# EAGLE design prototype2 (EAGLE 9.3.0)
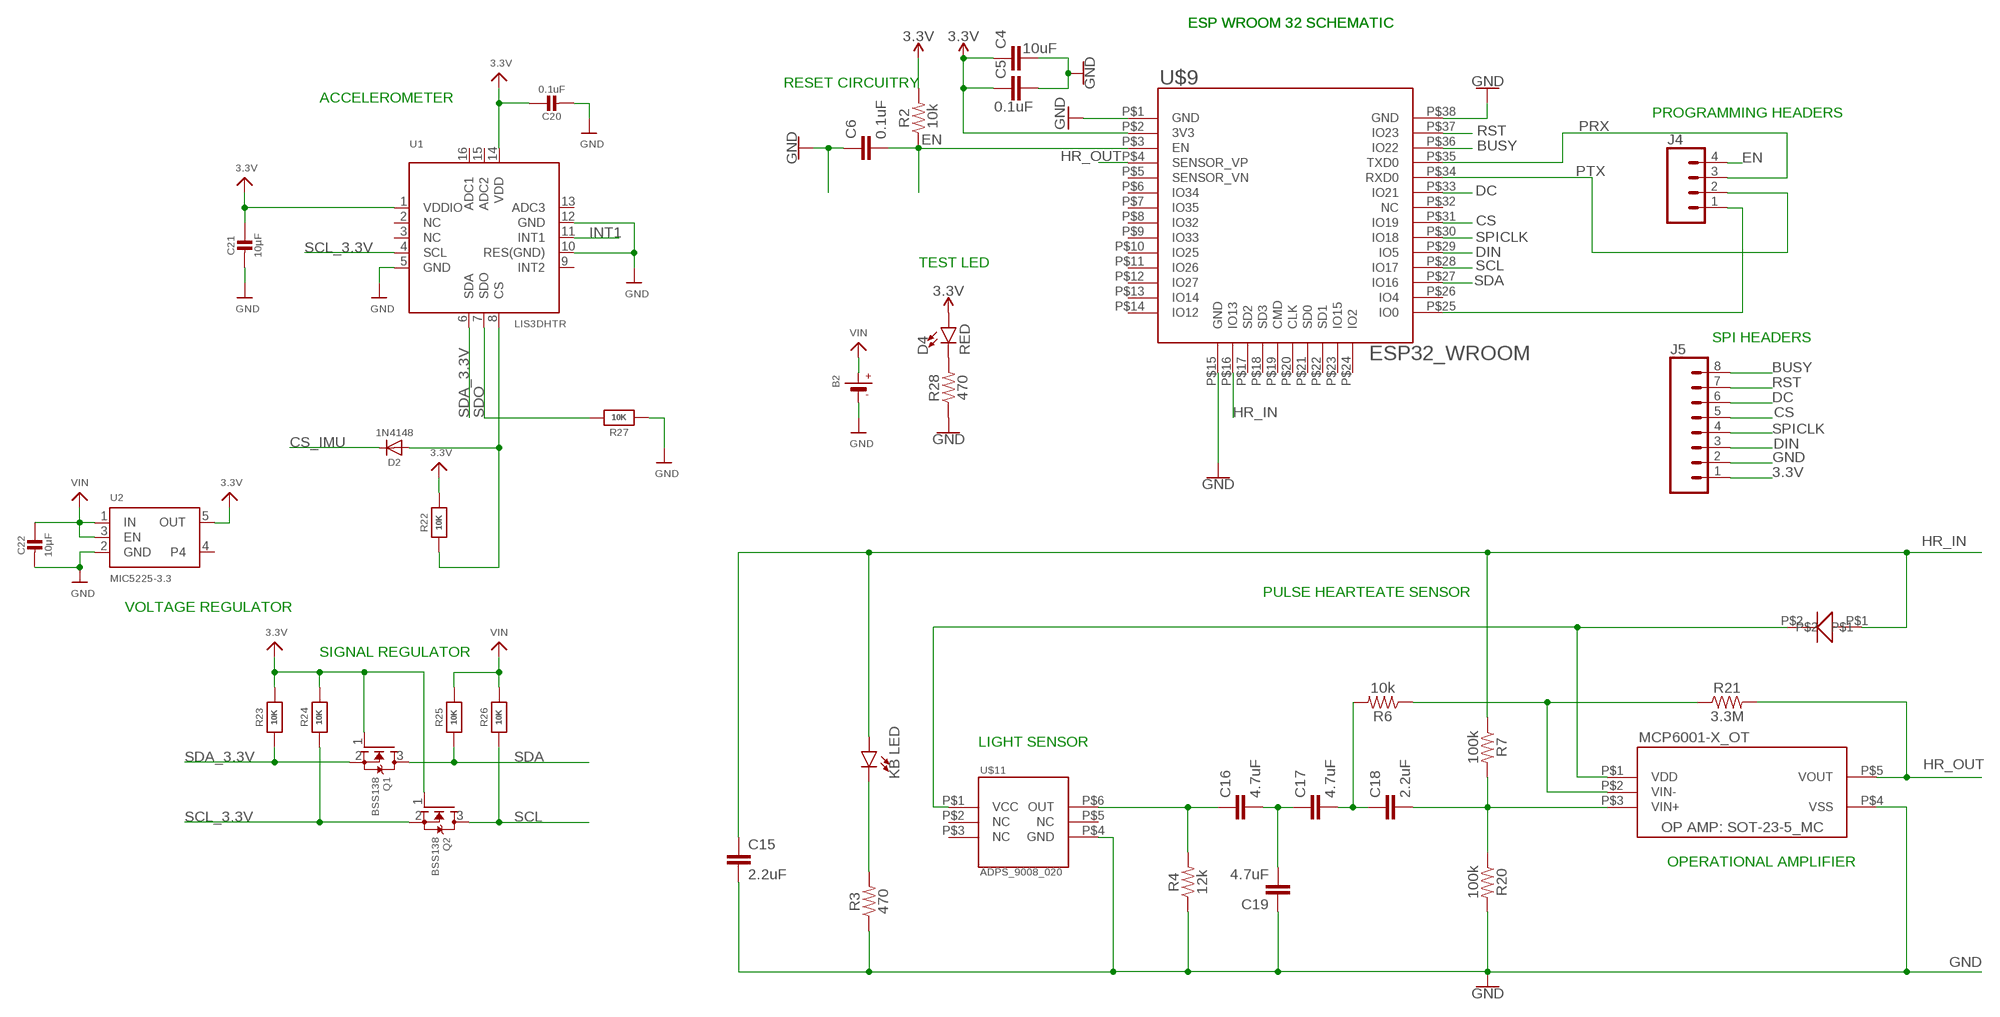
[diagram p0: schematic, sheet 1]

## Parts
B2  BATTERYCR2032_BAT-HLD-001  [CR2032_SMT_BAT-HLD-001]
C4  10uF  10UF-0603-6.3V-20%  [0603]
C5  0.1uF  0.1UF-0603-25V-(+80/-20%)  [0603]
C6  0.1uF  0.1UF-0603-25V-(+80/-20%)  [0603]
C15  2.2uF  2.2UF-0603-10V-20%  [0603]
C16  4.7uF  4.7UF0603  [0603]
C17  4.7uF  4.7UF0603  [0603]
C18  2.2uF  2.2UF-0603-10V-20%  [0603]
C19  4.7uF  4.7UF0603  [0603]
C20  0.1uF  CAP_CERAMIC_0603MP  [_0603MP]
C21  10µF  CAP_CERAMIC_0603  [_0603]
C22  10µF  CAP_CERAMIC_0603  [_0603]
D2  1N4148  DIODESOD-323  [SOD-323]
D4  RED  LED-RED0603  [LED-0603]
J4  CONN_04  [1X04]
J5  CONN_08"  [1X08]
Q1  BSS138  MOSFET-NWIDE  [SOT23-WIDE]
Q2  BSS138  MOSFET-NWIDE  [SOT23-WIDE]
R2  10k  RESISTOR0603  [0603]
R3  470  RESISTOR0603  [0603]
R4  12k  RESISTOR0603  [0603]
R6  10k  RESISTOR0603  [0603]
R7  100k  RESISTOR0603  [0603]
R20  100k  RESISTOR0603  [0603]
R21  3.3M  RESISTOR0603  [0603]
R22  10K  RESISTOR_0603  [_0603]
R23  10K  RESISTOR_0603  [_0603]
R24  10K  RESISTOR_0603  [_0603]
R25  10K  RESISTOR_0603  [_0603]
R26  10K  RESISTOR_0603  [_0603]
R27  10K  RESISTOR_0603  [_0603]
R28  470  RESISTOR0603  [0603]
U1  LIS3DHTR  ACCEL_LIS3DHTR  [LGA16_3X3MM]
U2  MIC5225-3.3  VREG_SOT23-5  [SOT23-5]
U$9  ESP32_WROOM  [ESP32_FP]
U$10  MCP6001-X_SOT-23-5  [SOT-23-5]
U$11  ADPS_9008_020  [ADPS_FP]
U$12  KB_REVMNT_LED  [REVMNT_LED_FP]
U$42  DI0603  [DIODE0603]

## Nets
3.3V: C4.1 C5.1 C20.1 C21.1 D4.A J5.1 Q1.1(G) Q2.1(G) R2.2 R22.2 R23.2 R24.2 U1.1(VDDIO) U1.14(VDD) U2.5(OUT) U$9.P$2(3V3)
BUSY: J5.8 U$9.P$36(IO22)
CS: J5.5 U$9.P$31(IO19)
CS_IMU: D2.C
DC: J5.6 U$9.P$33(IO21)
DIN: J5.3 U$9.P$29(IO5)
EN: C6.2 J4.4 R2.1 U$9.P$3(EN)
GND: B2.- C4.2 C5.2 C6.1 C15.2 C19.1 C20.2 C21.2 C22.2 J5.2 R3.1 R4.1 R20.2 R27.1 R28.1 U1.5(GND) U1.10(RES(GND)) U1.12(GND) U2.2(GND) U$9.P$1(GND) U$9.P$15(GND) U$9.P$38(GND) U$10.P$4(VSS) U$11.P$4(GND)
HR_IN: C15.1 R7.1 U$9.P$16(IO13) U$12.P$1(A) U$42.P$1
HR_OUT: R21.2 U$9.P$4(SENSOR_VP) U$10.P$5(VOUT)
INT1: U1.11(INT1)
N$3: J4.1 U$9.P$25(IO0)
N$4: C16.1 R4.2 U$11.P$6(OUT)
N$5: C16.2 C17.1 C19.2
N$6: C17.2 C18.1 R6.2
N$8: C18.2 R7.2 R20.1 U$10.P$3(VIN+)
N$12: R6.1 R21.1 U$10.P$2(VIN-)
N$13: U$10.P$1(VDD) U$11.P$1(VCC) U$42.P$2
N$18: R3.2 U$12.P$2(C)
N$19: D2.A R22.1 U1.8(CS)
N$20: D4.C R28.2
PRX: J4.3 U$9.P$35(TXD0)
PTX: J4.2 U$9.P$34(RXD0)
RST: J5.7 U$9.P$37(IO23)
SCL: Q2.3(D) R26.1 U$9.P$28(IO17)
SCL_3.3V: Q2.2(S) R24.1 U1.4(SCL)
SDA: Q1.3(D) R25.1 U$9.P$27(IO16)
SDA_3.3V: Q1.2(S) R23.1 U1.6(SDA)
SDO: R27.2 U1.7(SDO)
SPICLK: J5.4 U$9.P$30(IO18)
VIN: B2.+$1(+) B2.+$2(+) C22.1 R25.2 R26.2 U2.1(IN) U2.3(EN)
Unconnected: U1.2(NC) U1.3(NC) U1.9(INT2) U1.13(ADC3) U1.15(ADC2) U1.16(ADC1) U2.4 U$9.P$5(SENSOR_VN) U$9.P$6(IO34) U$9.P$7(IO35) U$9.P$8(IO32) U$9.P$9(IO33) U$9.P$10(IO25) U$9.P$11(IO26) U$9.P$12(IO27) U$9.P$13(IO14) U$9.P$14(IO12) U$9.P$17(SD2) U$9.P$18(SD3) U$9.P$19(CMD) U$9.P$20(CLK) U$9.P$21(SD0) U$9.P$22(SD1) U$9.P$23(IO15) U$9.P$24(IO2) U$9.P$26(IO4) U$9.P$32(NC) U$11.P$2(NC) U$11.P$3(NC) U$11.P$5(NC)

## Notes on the sheet
- ESP WROOM 32 SCHEMATIC | ESP WROOM 32 SCHEMATIC
- RESET CIRCUITRY
- ACCELEROMETER
- PROGRAMMING HEADERS
- TEST LED
- SPI HEADERS
- PULSE HEARTEATE SENSOR
- VOLTAGE REGULATOR
- SIGNAL REGULATOR
- LIGHT SENSOR
- OPERATIONAL AMPLIFIER

## Library data of the parts
B2 = microbuilder:BATTERY: CR1220 SMT - Digikey: 3001K-ND CD2032 BAT-HLD-001 - Digikey: BAT-HLD-001-ND
C4 = SparkFun-Capacitors:10UF: 10.0µF ceramic capacitors A capacitor is a passive two-terminal electrical component used to store electrical energy temporarily in an electric field.; PROD_ID: CAP-11015
C5 C6 = SparkFun-Capacitors:0.1UF: 0.1µF ceramic capacitors A capacitor is a passive two-terminal electrical component used to store electrical energy temporarily in an electric field.; PROD_ID: CAP-00810
C15 C18 = SparkFun-Capacitors:2.2UF: 2.2µF ceramic capacitors A capacitor is a passive two-terminal electrical component used to store electrical energy temporarily in an electric field.; PROD_ID: CAP-07888
C16 C17 C19 = SparkFun-Capacitors:4.7UF: 4.7µF ceramic capacitors A capacitor is a passive two-terminal electrical component used to store electrical energy temporarily in an electric field.; PROD_ID: CAP-08280
C20-C22 = microbuilder:CAP_CERAMIC: Ceramic Capacitors For new designs, use the packages preceded by an '_' character since they are more reliable: The following footprints should be used on most boards: _0402 - Standard footprint for regular board layouts _0603 - Standard footprint for regular board layouts _0805 - Standard footprint for regular board layouts _1206 - Standard footprint for regular board layouts For extremely tight-pitch boards where space is at a premium, the following 'micro-pitch' footprints can be used (smaller pads, no silkscreen outline, etc.): _0402MP - Micro-pitch footprint for very dense/compact boards _0603MP - Micro-pitch footprint for very dense/compact boards _0805MP - Micro-pitch footprint for very dense/compact boards _1206MP - Micro-pitch footprint for very dense/compact boards
D2 = microbuilder:DIODE: Diode SMA Model Volts Amps Type Vf Ir Digikey # Notes SSA34-E3 40V 3A Schottky 480mV @ 3A 200uA @ 40V SSA34-E3/61TGITR-ND CDBA120-G 20V 1A Schottky 500mV @ 1A 500uA @ 20V 641-1014-6-ND REEL MBRA210 10V 2A Schottky 350mV @ 2A 700uA @ 10V MBRA210LT3 SOD-123 Model Volts Amps Type Vf Ir Order # Notes BAT54T1G 30V 200mA Schottky 800mV @ 200mA 2uA @ 25V BAT54T1GOSTR-ND B0530W 30V 500mA Schottky 430mV @ 500mA 130uA @ 30V B0530W-FDICT-ND REEL MBR120 20V 1A Schottky 340mV @ 1A MBR120VLSFT1GOSCT-ND SOD-323 Model Volts Amps Type Vf Ir Order # Notes PMEG2005EJ 20V 500mA Schottky 355mV @ 500mA 568-4110-1-ND ZLLS410 10V 570mA Schottky 380mV @ 570mA ZLLS410CT-ND 1N4148WS 75V 150mA Silicon/Simple 1V 1N4148WSFSCT-ND REEL SOD-523 Model Volts Amps Type Vf Ir Order # Notes BAT54XV2 30V 200mA Schottky 0.8V @ 100mA BAT54XV2CT-ND TB751S 30V 30mA Schottky RB751S-40TE61CT-ND SOT23-R/W (R = Solder Paste/Reflow Ovens, W = Hand-Soldering) Model Volts Amps Type Vf Ir Order # Notes BAT54FILM 40V 300mA Schottky 497-7162-1-ND POWERDI-5 Model Volts Amps Type Vf Ir Order # Notes PDS560 60V 5A Schottky 670mV @ 5A 150uA @ 60V PDS560DICT-ND
D4 = SparkFun-LED:LED-RED: Red SMD LED Used in manufacturing of most products at SparkFun Packages: 0603 - SMD 0603 package [Product Link] <http://docs.avagotech.com/docs/AV02-0551EN> 0603 SMART - SMD 0603 SMART package ( more efficient and expensive)[Product Link] <http://www.osram-os.com/Graphics/XPic2/00077099_0.pdf> 1206 - SMD1206 package [Product Link] <https://www.sparkfun.com/datasheets/DevTools/LilyPad/Q150OVS4.pdff> SparkFun Products: Pro Mini 328 -5V <https://www.sparkfun.com/products/821> RedBoard <https://www.sparkfun.com/products/12757> IOIO-OTG <https://www.sparkfun.com/products/13613>; PROD_ID: DIO-00819
J4 = SparkFun-Connectors:CONN_04: Multi connection point. Often used as Generic Header-pin footprint for 0.1 inch spaced/style header connections On any of the 0.1 inch spaced packages, you can populate with these: Break Away Headers - Straight <https://www.sparkfun.com/products/116> (PRT-00116) Break Away Male Headers - Right Angle <https://www.sparkfun.com/products/553> (PRT-00553) Female Headers <https://www.sparkfun.com/products/115> (PRT-00115) Break Away Headers - Machine Pin <https://www.sparkfun.com/products/117> (PRT-00117) Break Away Female Headers - Swiss Machine Pin <https://www.sparkfun.com/products/743> (PRT-00743) For SCREWTERMINALS and SPRING TERMINALS visit here: Screw Terimnals on SparkFun.com <https://www.sparkfun.com/search/results?term=Screw+Terminals> (5mm/3.5mm/2.54mm spacing) This device is also useful as a general connection point to wire up your design to another part of your project. Our various solder wires solder well into these plated through hole pads. Hook-Up Wire - Assortment (Stranded, 22 AWG) <https://www.sparkfun.com/products/11375> (PRT-11375) Hook-Up Wire - Assortment (Solid Core, 22 AWG) <https://www.sparkfun.com/products/11367> (PRT-11367) View the entire wire category on our website here <https://www.sparkfun.com/categories/141> Special notes: Molex polarized connector foot print use with SKU : PRT-08231 with associated crimp pins and housings. 1MM SMD Version SKU: PRT-10208; PROD_ID: CONN-09696
J5 = SparkFun-Connectors:CONN_08: Multi connection point. Often used as Generic Header-pin footprint for 0.1 inch spaced/style header connections On any of the 0.1 inch spaced packages, you can populate with these: Break Away Headers - Straight <https://www.sparkfun.com/products/116> (PRT-00116) Break Away Male Headers - Right Angle <https://www.sparkfun.com/products/553> (PRT-00553) Female Headers <https://www.sparkfun.com/products/115> (PRT-00115) Break Away Headers - Machine Pin <https://www.sparkfun.com/products/117> (PRT-00117) Break Away Female Headers - Swiss Machine Pin <https://www.sparkfun.com/products/743> (PRT-00743) Arduino Stackable Header - 8 Pin <https://www.sparkfun.com/products/9279> (PRT-09279) For SCREWTERMINALS and SPRING TERMINALS visit here: Screw Terimnals on SparkFun.com <https://www.sparkfun.com/search/results?term=Screw+Terminals> (5mm/3.5mm/2.54mm spacing) This device is also useful as a general connection point to wire up your design to another part of your project. Our various solder wires solder well into these plated through hole pads. Hook-Up Wire - Assortment (Stranded, 22 AWG) <https://www.sparkfun.com/products/11375> (PRT-11375) Hook-Up Wire - Assortment (Solid Core, 22 AWG) <https://www.sparkfun.com/products/11367> (PRT-11367) View the entire wire category on our website here <https://www.sparkfun.com/categories/141> Special notes: Molex polarized connector foot print use with SKU : PRT-08231 with associated crimp pins and housings. 1MM SMD Version SKU: PRT-10208 NOTES ON THE VARIANTS LOCK and LOCK_LONGPADS... This footprint was designed to help hold the alignment of a through-hole component (i.e. 6-pin header) while soldering it into place. You may notice that each hole has been shifted either up or down by 0.005 of an inch from it's more standard position (which is a perfectly straight line). This slight alteration caused the pins (the squares in the middle) to touch the edges of the holes. Because they are alternating, it causes a "brace" to hold the component in place. 0.005 has proven to be the perfect amount of "off-center" position when using our standard breakaway headers. Although looks a little odd when you look at the bare footprint, once you have a header in there, the alteration is very hard to notice. Also,if you push a header all the way into place, it is covered up entirely on the bottom side.; PROD_ID: CONN-08438
Q1 Q2 = microbuilder:MOSFET-N: N-Channel Mosfet LEGEND VDS: Voltage Drain-Source ID: Drain Current RDS(ON): Drain-Source On-State Resistance VGS(TH): Gate-Source Threshold Voltage CISS: Drain-Source Input Capacitance SOT-23 Name VDS ID RDS(ON) VGS(TH) CISS Order Number 2N7002E 60V 260mA 2.5 Ohm 2.5V @ 250uA 26.7pF @ 25V 2N7002ET1GOSTR-ND BSH103 30V 850mA 400 mOhm 400mV @ 1mA 83pF @ 24V BSH103,235-ND BSS138 60V 320mA 1.6 Ohm 1.5V @ 250uA 50pF @ 10V Mouser: 771-BSS138PW115 DMN2075U-7 20V 4.2A 38 mOhm 1V @ 250 uA 594.3pF @ 10V DMN2075U-7DICT-ND * BSS138 good choice for I2C level-shifting POWERPAK 1212-8 Name VDS ID RDS(ON) VGS(TH) CISS Order Number Si7308DN 60V 6A 58 mOhm 3V @ 250uA 665pF @ 15V SI7308DN-T1-E3CT-ND
R2-R4 R6 R7 R20 R21 R28 = SparkFun-Resistors:RESISTOR: Generic Resistor Package
R22-R27 = microbuilder:RESISTOR: Resistors For new designs, use the packages preceded by an '_' character since they are more reliable: The following footprints should be used on most boards: _0402 - Standard footprint for regular board layouts _0603 - Standard footprint for regular board layouts _0805 - Standard footprint for regular board layouts _1206 - Standard footprint for regular board layouts For extremely tight-pitch boards where space is at a premium, the following 'micro-pitch' footprints can be used (smaller pads, no silkscreen outline, etc.): _0402MP - Micro-pitch footprint for very dense/compact boards _0603MP - Micro-pitch footprint for very dense/compact boards _0805MP - Micro-pitch footprint for very dense/compact boards _1206MP - Micro-pitch footprint for very dense/compact boards
U1 = microbuilder:ACCEL_LIS3DHTR: LIS3DHTR 3-Axis Accelerometer with I2C/SPI Interface VDD: 1.71-3.6V VDDIO: 1.71-VDD+0.1V Scale: +/-2g, 4g, 8g, 16g with 16--bit data output Temp:: -40°C - 85°C Mouser: 511-LIS3DHTR Digikey: 497-10613-1-ND
U2 = microbuilder:VREG_SOT23-5: SOT23-5 Fixed Voltage Regulators Part Current Out V Out V In V Dropout θJA (°C/W) TJ (°C) Digikey Part No. ADP121 150mA 3.3V 3.4-5.5V 0.09V @ 150mA -- -- ADP121-AUJZ33R7CT-ND ADP121 150mA 3.0V 3.1-5.5V 0.09V @ 150mA -- -- ADP121-AUJZ30R7CT-ND ADP122 300mA 3.3V 3.4-5.5V 0.085V @ 300mA -- -- ADP122AUJZ-3.3-R7CT-ND ADP1712 300mA 3.3V 3.5-5.5V 0.17V @ 300mA -- -- ADP1712AUJZ-3.3-R7TR-ND AP7311 (Low Cost) 150mA 3.3V 3.5-6V 0.15V @ 150mA -- -- AP7311-33WG-7DICT-ND LD39015M18R 150mA 1.8V 1.9V-5.5V 0.08V @ 100mA -- -- 497-6977-1-ND LP2985A-33DBVR 150mA 3.3V 3.3-16V 0.28V @ 150mA 206 150 296-18479-1-ND MCP1824T-3302E/OT 300mA 3.3V 3.5V-6V 0.2V @ 300mA -- -- MCP1824T-3302E/OTCT-ND MIC5205-2.5YM5 TR 150mA 2.5V 2.7-16V 0.165V @ 150mA -- -- 576-1257-2-ND MIC5205-3.0YM5 TR 150mA 3.0V 3.2V-16V 0.165V @ 150mA -- -- 576-1258-2-ND MIC5205-3.3YM5 TR 150mA 3.3V 3.5V-16V 0.165V @ 150mA -- -- 576-1259-2-ND TPS780330220 150mA 3.3V+2.2V 3.6-5.5V 250mV Max -- -- 296-23332-1-ND TDA3663/N1,135 100mA 3.3V 3.5-45V 0.18V @ 50mA -- -- 568-5343-1-ND Max operating temp can be calculated using θJA, TJ (max junction temperature), and power in watts. Set the "Maximum Ambient Temperature" until it reaches TJ ("Max Junction Temperature"), which is the absolute limit for safe use of the regulator: Heat Sink Temperature Calculator <http://www.daycounter.com/Calculators/Heat-Sink-Temperature-Calculator.phtml> For example, With 12V source into a 3.3V LP2985 and a 30mA load, we are dissipating (12V-3.3V) * 0.03A = 0.261W. With a θJA of 206 °C/W, a TJ of 150°C, and 261mW we can safely use the chip without a heat sink up to 75°C (=147.1°C Junction Temperature).
U$9 = HMD_Library:ESP32_WROOM
U$10 = HMD_Library:MCP6001-X_SOT-23-5: MCP6001-X: Operational Amplifier, 5-Lead Plastic Small Outline Transistor SOT-23-5
U$11 = HMD_Library:ADPS_9008_020
U$12 = HMD_Library:KB_REVMNT_LED
U$42 = HMD_Library:DI0603

## Board
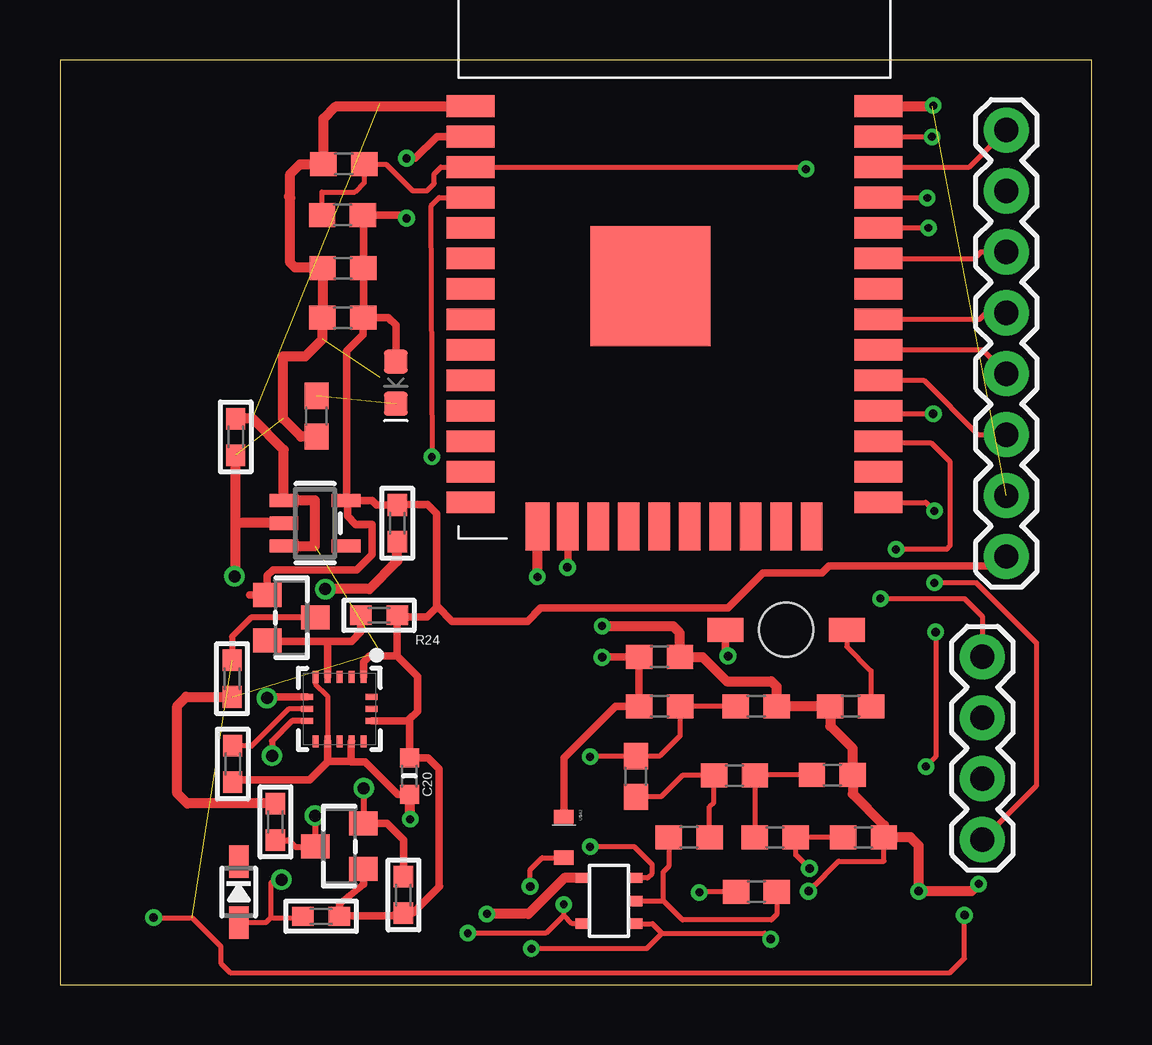
[diagram p1: board, top side]
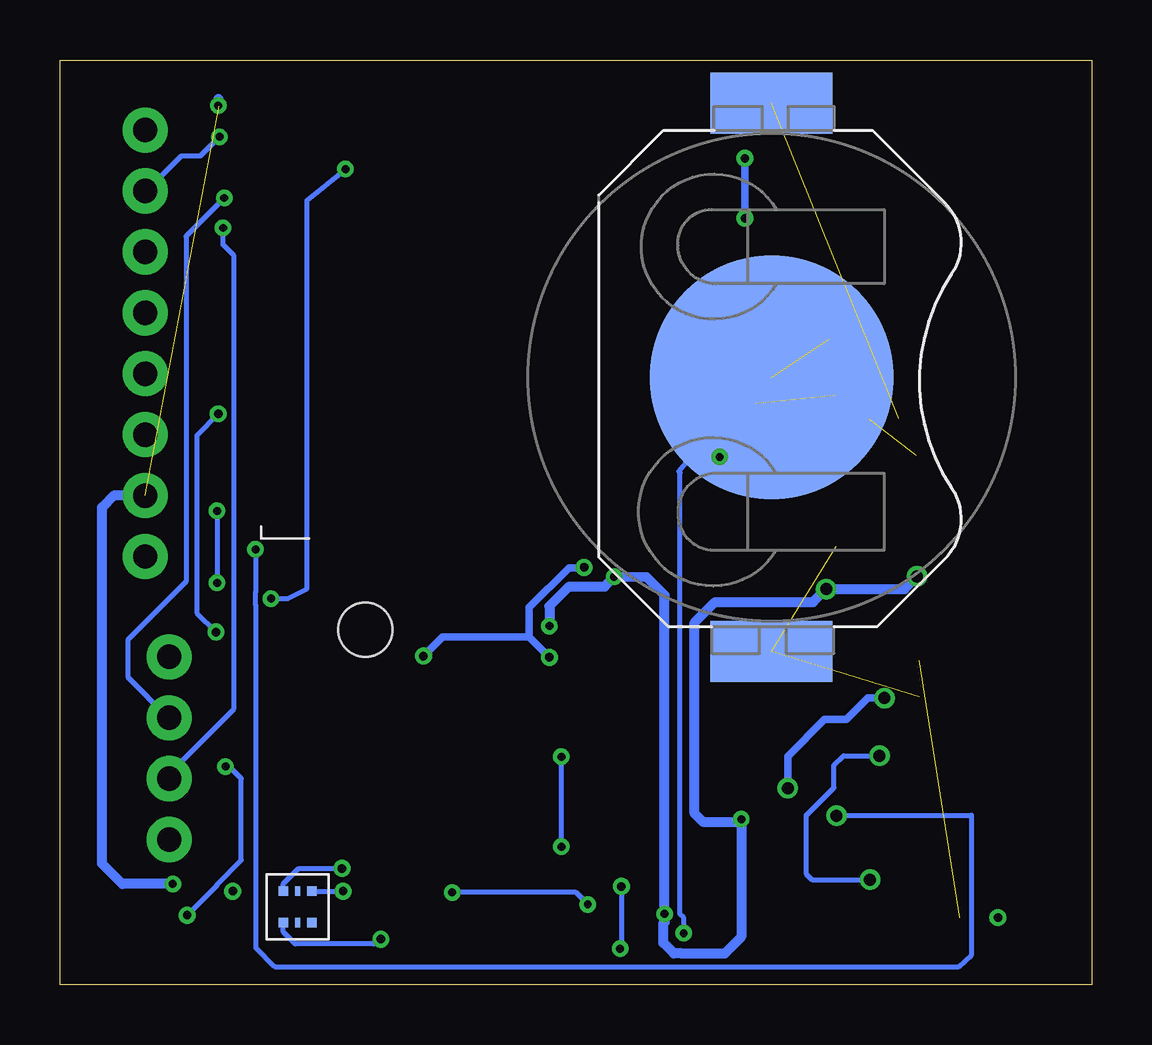
[diagram p2: board, bottom side, seen from below]

Size 43 x 38.55 mm. Coordinates in mm from the lower left corner, seen from the top.
Outline: 0,0 43,0 43,38.55 0,38.55 0,0
Copper layers (1*16): Top 0.0356mm / dielectric 1.5011mm / Bottom 0.0356mm
Design rules "ECE_Senior_Design": minimum track width 8mil, minimum drill 13mil, track to track 8mil, track to pad 8mil, pad to pad 6mil, via to via 8mil, smd to smd 6mil, copper to edge 15mil, drill to drill 8mil, minimum pad ring 7mil, minimum via ring 7mil, stop-mask expansion 3mil, vias tented up to drill 0mil, thermal gap 10mil

### Footprints (pad centres in the part's own frame; a part is rotated, then mirrored left to right if it is on the bottom)
CR2032_SMT_BAT-HLD-001 = smd 2.54 x 5.08: +$1 -11.43,0; +$2 11.43,0 | smd 10.16 x 10.16: - 0,0
0603 = smd 1.1 x 1: 1 -0.85,0; 2 0.85,0
_0603MP = smd 0.8 x 0.8: 1 -0.762,0; 2 0.762,0
_0603 = smd 0.9 x 0.8: 1 -0.762,0; 2 0.762,0
SOD-323 = smd 1.35 x 0.8: A 1.27,0; C -1.27,0
LED-0603 = smd 1 x 1: A -0.877,0; C 0.877,0
1X04 = drill 1.016 pad 1.88: 1 0,0; 2 2.54,0; 3 5.08,0; 4 7.62,0
1X08 = drill 1.016 pad 1.88: 1 0,0; 2 2.54,0; 3 5.08,0; 4 7.62,0; 5 10.16,0; 6 12.7,0; 7 15.24,0; 8 17.78,0
SOT23-WIDE = smd 1 x 1.2: 1 -0.95,-1; 2 0.95,-1; 3 0,1
LGA16_3X3MM = smd 0.5 x 0.25: 1 -1.35,1; 2 -1.35,0.5; 3 -1.35,0; 4 -1.35,-0.5; 5 -1.35,-1; 9 1.35,-1; 10 1.35,-0.5; 11 1.35,0; 12 1.35,0.5; 13 1.35,1 | smd 0.25 x 0.5: 6 -0.5,-1.35; 7 0,-1.35; 8 0.5,-1.35; 14 0.5,1.35; 15 0,1.35; 16 -0.5,1.35
SOT23-5 = smd 0.55 x 1.2: 1 -0.95,-1.3; 2 0,-1.3; 3 0.95,-1.3; 4 0.95,1.3; 5 -0.95,1.3
ESP32_FP = smd 2 x 0.9: P$1 -8.5,5.51; P$2 -8.5,4.24; P$3 -8.5,2.97; P$4 -8.5,1.7; P$5 -8.5,0.43; P$6 -8.5,-0.84; P$7 -8.5,-2.11; P$8 -8.5,-3.38; P$9 -8.5,-4.65; P$10 -8.5,-5.92; P$11 -8.5,-7.19; P$12 -8.5,-8.46; P$13 -8.5,-9.73; P$14 -8.5,-11; P$25 8.5,-11; P$26 8.5,-9.73; P$27 8.5,-8.46; P$28 8.5,-7.19; P$29 8.5,-5.92; P$30 8.5,-4.65; P$31 8.5,-3.38; P$32 8.5,-2.11; P$33 8.5,-0.84; P$34 8.5,0.43; P$35 8.5,1.7; P$36 8.5,2.97; P$37 8.5,4.24; P$38 8.5,5.51 | smd 1 x 2: P$15 -5.715,-12 | smd 0.9 x 2: P$16 -4.445,-12; P$17 -3.175,-12; P$18 -1.905,-12; P$19 -0.635,-12; P$20 0.635,-12; P$21 1.905,-12; P$22 3.175,-12; P$23 4.445,-12; P$24 5.715,-12 | smd 5 x 5: P$39 -1,-1.99
SOT-23-5 = smd 0.584 x 0.432: P$1 -1.105,0.953; P$2 -1.105,0.013; P$3 -1.105,-0.953; P$4 1.105,-0.953; P$5 1.105,0.953
ADPS_FP = smd 0.4 x 0.4: P$1 0.6,0.65; P$3 -0.6,0.65; P$4 -0.6,-0.65; P$6 0.6,-0.65 | smd 0.2 x 0.4: P$2 0,0.65; P$5 0,-0.65
REVMNT_LED_FP = smd 1.5 x 1: P$1 2.525,0; P$2 -2.525,0 | hole 2.25: 0,0
DIODE0603 = smd 0.6 x 0.8: P$1 -0.85,0; P$2 0.85,0

### Placement (x,y rotation side)
B2  13.34,25.32 90 bottom
C4  11.8,29.87 180 top
C5  11.79,27.81 180 top
C6  11.83,34.2 0 top
C15  24.99,13.66 0 top
C16  29.81,6.15 180 top
C17  28.12,8.72 180 top
C18  24,8.68 90 top
C19  32.19,8.74 180 top
C20  14.57,8.7 270 top
C21  14.06,19.24 270 top
C22  7.33,22.84 270 top
D2  7.46,3.87 270 top
D4  14,25.1 270 top
J4  38.45,6.05 90 top
J5  39.45,17.85 90 top
Q1  11.65,5.78 90 top
Q2  9.64,15.3 270 top
R2  11.78,32.08 0 top
R3  32.96,11.6 0 top
R4  33.49,6.15 180 top
R6  26.23,6.15 0 top
R7  25,11.61 0 top
R20  29.02,11.6 0 top
R21  29.03,3.88 180 top
R22  10.88,2.85 0 top
R23  14.31,3.74 270 top
R24  13.3,15.4 0 top
R25  8.98,6.79 90 top
R26  7.17,12.76 270 top
R27  7.2,9.2 90 top
R28  10.7,23.7 90 top
U1  11.65,11.49 270 top
U2  10.63,19.24 270 top
U$9  25.61,31.11 0 top
U$10  22.88,3.5 180 top
U$11  33.1,3.25 180 bottom
U$12  30.27,14.8 180 top
U$42  21,6.15 270 top

### Tracks (layer width: path | path; a pad name or v marks a point on that pad's centre or on a via)
3.3V  (via drill 0.35)
  Top 0.305: C5.1 C4.1 12.65,32.06 R2.2 14.32,32.08 v14.45,31.95 | C5.1 12.64,27.11 11.94,26.41 U2.5 | U$9.P$2 15.71,35.35 14.81,34.45 v14.45,34.45 | J5.1 39.05,17.45 32.05,17.45 31.76,17.16 29.31,17.16 27.85,15.7 20.04,15.7 19.49,15.15 16.35,15.15 15.73,15.77 15.7,15.74 | U2.5 11.98,20.14 11.98,19.54 12.33,19.19 13.02,19.19 13.02,17.94 12.36,17.29 8.88,17.29 8.64,17.05 Q2.1 7.92,16.25 7.92,16.24 | 13.81,20.25 C21.1 | Q1.1 12.65,4.18 11.65,3.37 R22.2 11.67,2.88 13.91,2.88 14.01,2.98 R23.2 14.34,3 14.72,3 15.8,4.09 | U2.5 11.99,20.25 | 15.7,15.74 15.3,15.34 14.12,15.34 R24.2 14.05,15.39 14.05,13.7 | 15.7,15.74 15.7,19.65 15.33,20.02 14.08,20.02 C21.1 | U1.1 12.65,13.45 12.9,13.7 14.05,13.7 | 14.05,13.7 14.9,12.85 14.9,11.4 14.55,11.05 | D4.A 14,27.5 13.69,27.81 C5.1 | U2.5 13.01,20.19 13.2,20 C21.1 | 15.8,4.09 15.8,9 15.34,9.46 C20.1 14.57,11.03 14.55,11.05 | U1.14 13.01,11 14.5,11 14.55,11.05 | 15.8,4.09 15.81,4.1
  Top 0.406: U2.5
  Bottom 0.305: v14.45,34.45 v14.45,31.95
BUSY
  Top 0.203: U$9.P$36 37.9,34.08 J5.8
CS
  Top 0.203: J5.5 38.61,28.01 38.33,27.73 U$9.P$31
DC
  Top 0.203: U$9.P$33 38.12,30.27 38.4,30.55 J5.6
DIN
  Top 0.203: U$9.P$29 36,25.2 38.27,22.93 J5.3
EN  (via drill 0.33)
  Top 0.203: C6.2 13.59,34.2 14.7,33.1 15.3,33.1 15.6,33.4 15.6,33.8 15.88,34.08 U$9.P$3 31.02,34.08 v31.1,34 | C6.2 12.68,33.43 12.3,33.05 10.93,33.05 R2.1 | 12.8,34.32 C6.2 | J4.4 38.45,15.35 37.7,16.1 v34.2,16.1
  Bottom 0.203: v34.2,16.1 33.5,16.1 32.7,16.5 32.7,32.7 v31.1,34
GND  (via drill 0.33, 0.35, 0.5)  (3 unrouted)
  Top 0.203: U1.10 11.15,12.03 10.64,12.54 U1.5 | v31.2,3.9 31.49,4.19 31.52,4.19 31.9,4.58 31.9,4.6 32.45,5.15 34.35,5.15 R4.1
  Top 0.305: C20.2 14.07,7.93 12.72,9.29 12.13,9.29 | U1.10 11.15,9.3 | 11.15,9.3 11.15,9.28 10.4,8.54 7.3,8.54 | 12.13,9.29 12.13,10.12 U1.12 | 12.13,9.29 12.11,9.3 11.15,9.3
  Top 0.406: U$10.P$4 21.03,4.45 19.53,2.95 v17.8,2.95 | v38.3,4.2 38,3.9 v35.8,3.9 35.8,5.8 35.45,6.15 R4.1 34.34,6.65 33.04,7.95 C19.1 33.04,9.85 32.11,10.78 R3.1 R20.2 29.87,12.43 29.65,12.65 27.8,12.65 26.79,13.66 C15.2 25.84,14.66 25.57,14.94 22.61,14.94 v22.6,14.95 | U$9.P$38 36.37,36.62 v36.4,36.65 | U$9.P$1 17.09,36.6 11.48,36.6 10.98,36.1 C6.1 10,34.2 9.6,33.8 9.6,32.8 | C22.2 7.33,19.25 | v11.06,16.5 12.9,16.5 14.06,17.66 C21.2 | R27.1 7.3,8.54 | C20.2 14.57,6.93 v14.6,6.9 | U$9.P$15 v19.9,17 | R28.1 10.05,22.85 9.3,23.6 9.3,26.2 10.23,26.2 10.94,26.91 C5.2 C4.2 10.92,29.9 9.8,29.9 9.6,30.1 9.6,32.8 | 9.54,32.86 9.6,32.8 | v7.28,17.02 7.33,17.07 7.33,19.25 | U2.2 9.32,19.25 7.33,19.25
  Bottom 0.203: U$11.P$4 v31.2,3.9
  Bottom 0.406: J5.2 40.76,20.39 41.25,19.9 41.25,5.05 40.4,4.2 v38.3,4.2 | v22.6,14.95 22.6,15.78 21.78,16.6 20.3,16.6 v19.9,17 18.54,16.98 17.8,16.25 v17.8,2.95 17.8,2.61 17.85,2.56 17.85,1.74 17.41,1.3 17.1,1.3 15.3,1.3 14.6,2 v14.6,6.9 14.7,6.8 16.2,6.8 16.54,7.14 16.54,15.1 15.69,15.95 11.61,15.95 v11.06,16.5 7.8,16.5 v7.28,17.02 7.29,17.01 | 36.4,36.93 v36.4,36.65
HR_IN  (via drill 0.35)
  Top 0.203: 24.14,11.6 R7.1
  Top 0.305: U$42.P$1 21,9.45 23.15,11.6 24.14,11.6 | R7.1 C15.1 v22.61,13.66 v22.6,13.65 | v27.85,13.7 27.75,13.8 U$12.P$1 | v21.15,17.4 21.17,17.42 U$9.P$16
  Bottom 0.305: v22.6,13.65 23.45,14.5 | v27.85,13.7 27.05,14.5 23.45,14.5 | 23.45,14.5 23.45,15.72 21.79,17.38 21.17,17.38 v21.15,17.4
HR_OUT  (via drill 0.33)
  Top 0.203: U$9.P$4 15.81,32.81 15.45,32.45 15.51,22.02 v15.5,22 | R21.2 26.68,3.88 v26.65,3.85 | U$10.P$5 21.35,2.55 21,2.9 | 21,2.9 v21,3.35 | 21,2.9 20.25,2.15 v17,2.15
  Bottom 0.203: v21,3.35 21.5,3.85 v26.65,3.85 | v15.5,22 16.7,22 17.2,21.4 17.15,21.35 17.15,2.93 17,2.78 v17,2.15
N$3  (via drill 0.33)
  Top 0.203: J4.1 40.7,8.3 40.7,14.25 38.2,16.75 v36.45,16.75 | U$9.P$25 36.09,20.11 v36.45,19.75
  Bottom 0.203: v36.45,19.75 v36.45,16.75
N$4  (via drill 0.35)
  Top 0.203: R4.2 C16.1 30.66,5.43 v31.25,4.85
  Bottom 0.203: U$11.P$6 33.7,4.2 33.04,4.85 v31.25,4.85
N$5
  Top 0.203: C16.2 C17.1 28.99,8.74 C19.2
N$6
  Top 0.203: C17.2 27.25,8.72 | 27.25,8.72 25.94,8.72 25.05,7.83 C18.1 | R6.2 27.08,7.43 27.25,7.6 27.25,8.72
N$8  (via drill 0.33)
  Top 0.203: R20.1 R7.2 25.85,10.38 25,9.53 C18.2 22.13,9.53 v22.1,9.5 | U$10.P$3 24.49,4.45 24.69,4.65 24.69,5 23.94,5.75 v22.1,5.75
  Bottom 0.203: v22.1,5.75 v22.1,9.5
N$12
  Top 0.203: R6.1 25.38,4.93 25.15,4.7 25.15,3.5 | R21.1 29.88,2.93 29.65,2.7 25.95,2.7 25.15,3.5 | U$10.P$2 25.14,3.49 25.15,3.5
N$13  (via drill 0.33, 0.35)
  Top 0.203: U$10.P$1 24.7,2.55 25.1,2.15 | 25.1,2.15 29.37,2.15 v29.62,1.9 | 25.1,2.15 24.45,1.5 v19.65,1.5 | 19.65,4.1 v19.6,4.1 19.6,4.8 20.1,5.3 U$42.P$2
  Bottom 0.203: 29.62,2 v29.62,1.9 29.73,1.9 29.93,1.7 33.2,1.7 33.7,2.2 U$11.P$1 | v19.6,4.1 19.6,1.55 v19.65,1.5
N$18
  Top 0.203: U$12.P$2 32.8,14.1 33.81,13.09 R3.2
N$19  (via drill 0.5)
  Top 0.203: R22.1 10.06,2.79 | 10.06,2.79 | v9.23,4.38 8.93,4.38 8.78,4.23 8.78,2.81 8.8,2.79 | D2.A 8.58,2.6 8.77,2.79 8.8,2.79 | 8.8,2.79 10.06,2.79
  Top 0.254: U1.8 9.68,10.99 8.83,10.15 v8.83,9.55
  Bottom 0.203: v9.23,4.38 11.65,4.38 11.9,4.63 11.9,7.04 10.73,8.21 10.73,9.16 10.34,9.55 v8.83,9.55
N$20  (1 unrouted)
PRX  (via drill 0.33)
  Top 0.203: v36.15,32.8 34.12,32.8 U$9.P$35
  Bottom 0.203: J4.3 38.48,11.13 40.15,12.8 40.15,14.4 37.75,16.8 37.75,31.2 v36.15,32.8
PTX  (via drill 0.33)
  Top 0.203: U$9.P$34 v36.2,31.55
  Bottom 0.203: J4.2 38.45,8.79 35.74,11.5 35.74,30.39 36.2,30.85 v36.2,31.55
RST  (via drill 0.33)
  Top 0.203: v36.35,35.35 U$9.P$37
  Bottom 0.203: J5.7 39.4,33.09 37.94,34.55 37.15,34.55 v36.35,35.35
SCL  (via drill 0.33, 0.35)  (1 unrouted)
  Top 0.203: U$9.P$28 34.23,23.8 v36.4,23.8 | v3.9,2.8 5.5,2.8 6.7,1.6 6.7,0.9 7.1,0.5 37.1,0.5 37.7,1.1 v37.7,2.9 37.7,3 | v36.5,14.7 36.5,9.5 v36.1,9.1
  Top 0.254: Q2.3 7.96,15.3 7.17,14.51 R26.1
  Bottom 0.203: v36.4,23.8 37.3,22.9 37.3,15.5 v36.5,14.7 | v3.9,2.8 4,2.8 | v37.7,2.9 36.46,4.14 36.46,4.17 35.44,5.19 35.44,8.6 | 35.44,8.6 | 35.44,8.6 35.94,9.1 v36.1,9.1
SCL_3.3V
  Top 0.305: 11.2,14.32 12.15,14.32 12.54,14.71 R24.1 | 11.2,14.32 8.67,14.32 Q2.2 | U1.4 11.15,14.27 11.2,14.32
SDA  (via drill 0.33, 0.5)
  Top 0.203: U$9.P$27 34.16,22.6 36.3,22.6 37.1,21.8 37.1,18.3 36.95,18.15 v34.85,18.15
  Top 0.254: Q1.3 10.65,5.8 10.65,7.03 v10.63,7.04 | R25.1 9.52,6.03 9.8,5.75 10.6,5.75
  Top 0.305: 10.6,5.75 10.65,5.8
  Bottom 0.203: v10.63,7.04 10.63,7.06 5,7.06 5,1.25 5.54,0.75 34.05,0.75 34.83,1.53 34.83,15.82 34.85,15.83 34.85,16.37 34.83,16.38 34.83,18.13 v34.85,18.15
SDA_3.3V  (via drill 0.5)
  Top 0.254: 8.66,11.99 v8.63,11.95 | Q1.2 12.65,8.17 v12.66,8.19
  Top 0.305: Q1.2 13.64,6.72 14.31,6.05 R23.1 | U1.6 8.66,11.99
  Bottom 0.305: v8.63,11.95 9.33,11.95 10.23,11.05 11.13,11.05 12.66,9.52 v12.66,8.19
SDO
  Top 0.203: U1.7 9.53,11.49 7.99,9.95 7.22,9.95 R27.2
SPICLK
  Top 0.203: J5.4 38.47,26.45 34.12,26.45 U$9.P$30
VIN  (3 unrouted)
  Top 0.406: C22.1 8.03,23.6 9.33,22.3 U2.1 10.63,20.19 10.63,18.29 U2.3 | R25.2 5.31,7.55 4.89,7.98 4.89,11.63 5.26,12 R26.2